# EAGLE schematic comms_dropper_robot (EAGLE 9.6.2)
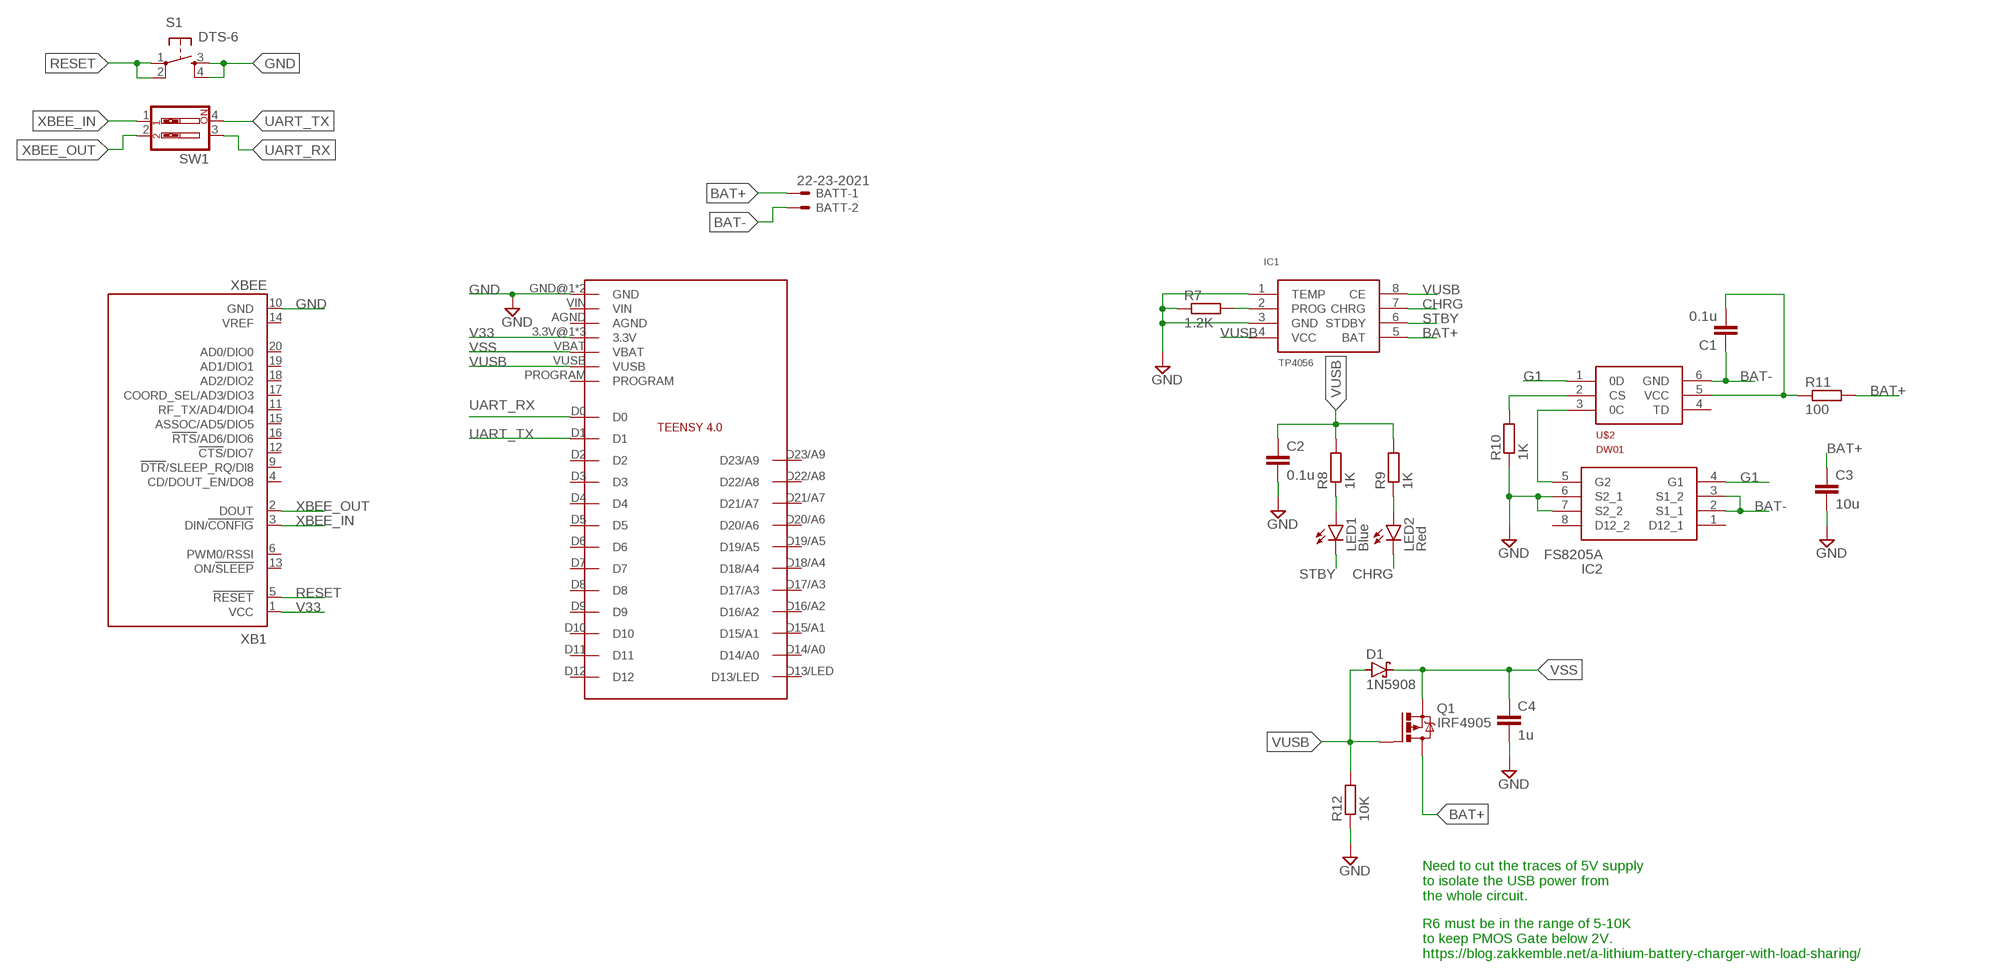
[diagram p0: schematic, sheet 1]

## Parts
BATT  22-23-2021  [22-23-2021]
C1  0.1u  C2,5-3  [C2.5-3]
C2  0.1u  C2,5-3  [C2.5-3]
C3  10u  C2,5-3  [C2.5-3]
C4  1u  C2,5-3  [C2.5-3]
D1  1N5908  [C4111-15]
IC1  TP4056  [SOP-8]
IC2  FS8205A  [SOP65P640X120-8N]
LED1  Blue  LED3MM  [LED3MM]
LED2  Red  LED3MM  [LED3MM]
Q1  IRF4905  [TO220BH]
R7  1.2K  R-EU_R0805  [R0805]
R8  1K  R-EU_R0805  [R0805]
R9  1K  R-EU_R0805  [R0805]
R10  1K  R-EU_R0805  [R0805]
R11  100  R-EU_R0805  [R0805]
R12  10K  R-EU_R0805  [R0805]
S1  DTS-6  [DTS-6]
SW1  SW_DIP-2  [EDG-02]
U$1  TEENSY4.0  [TEENSY4.0]
U$2  DW01  [SOT23-6]
XB1  XBEE  [XBEE]

## Nets
BAT+: BATT.1 C3.1 IC1.5(BAT) Q1.D R11.2
BAT-: BATT.2 C1.1 IC2.2(S1_1) IC2.3(S1_2) U$2.6(GND)
CHRG: IC1.7(CHRG) LED2.K(C)
G1: IC2.4(G1) U$2.1(0D)
GND: C2.2 C3.2 C4.2 IC1.1(TEMP) IC1.3(GND) IC2.6(S2_1) IC2.7(S2_2) R7.1 R10.1 R12.1 S1.3 S1.4 U$1.GND@1(GND) U$1.GND@2(GND) XB1.10(GND)
N$1: IC2.5(G2) U$2.3(0C)
N$2: IC1.2(PROG) R7.2
N$3: R10.2 U$2.2(CS)
N$4: C1.2 R11.1 U$2.5(VCC)
N$7: LED1.A R8.1
N$8: LED2.A R9.1
RESET: S1.1 S1.2 XB1.5(!RESET)
STBY: IC1.6(STDBY) LED1.K(C)
UART_RX: SW1.3 U$1.D0
UART_TX: SW1.4 U$1.D1
V33: U$1.3.3V@1(3.3V) U$1.3.3V@2(3.3V) U$1.ON/OFF(3.3V) XB1.1(VCC)
VSS: C4.1 D1.C Q1.S U$1.VBAT
VUSB: C2.1 D1.A IC1.4(VCC) IC1.8(CE) Q1.G R8.2 R9.2 R12.2 U$1.VUSB
XBEE_IN: SW1.1 XB1.3(DIN/!CONFIG)
XBEE_OUT: SW1.2 XB1.2(DOUT)
Unconnected: IC2.1(D12_1) IC2.8(D12_2) U$1.AGND U$1.D2 U$1.D3 U$1.D4 U$1.D5 U$1.D6 U$1.D7 U$1.D8 U$1.D9 U$1.D10 U$1.D11 U$1.D12 U$1.D13/LED U$1.D14/A0 U$1.D15/A1 U$1.D16/A2 U$1.D17/A3 U$1.D18/A4 U$1.D19/A5 U$1.D20/A6 U$1.D21/A7 U$1.D22/A8 U$1.D23/A9 U$1.PROGRAM U$1.VIN U$2.4(TD) XB1.4(CD/DOUT_EN/DO8) XB1.6(PWM0/RSSI) XB1.9(!DTR!/SLEEP_RQ/DI8) XB1.11(RF_TX/AD4/DIO4) XB1.12(!CTS!/DIO7) XB1.13(ON/!SLEEP) XB1.14(VREF) XB1.15(ASSOC/AD5/DIO5) XB1.16(!RTS!/AD6/DIO6) XB1.17(COORD_SEL/AD3/DIO3) XB1.18(AD2/DIO2) XB1.19(AD1/DIO1) XB1.20(AD0/DIO0)

## Notes on the sheet
- Need to cut the traces of 5V supply 
  to isolate the USB power from 
  the whole circuit.
- R6 must be in the range of 5-10K 
  to keep PMOS Gate below 2V.
  https://blog.zakkemble.net/a-lithium-battery-charger-with-load-sharing/

## Library data of the parts
BATT = con-molex:22-23-2021: .100" (2.54mm) Center Header - 2 Pin; MF: MOLEX; MPN: 22-23-2021; OC_FARNELL: 1462926; OC_NEWARK: 25C3832
C1-C4 = capacitor-wima:C: CAPACITOR naming: grid - package width
D1 = diode:1N5908: DIODE schottky
IC1 = TP4056:TP4056
IC2 = FS8205A:FS8205A: Dual N-Channel Enhancement Mode power MOSFET, TSSOP8 Source: Datasheet <https://datasheet.lcsc.com/szlcsc/Fortune-Semicon-FS8205A_C16052.pdf>; DESCRIPTION: Dual N-Channel Enhancement Mode power MOSFET, TSSOP8; HEIGHT: 1.2mm; MANUFACTURER_NAME: Fortune Semicon; MANUFACTURER_PART_NUMBER: FS8205A
LED1 LED2 = led:LED: LED OSRAM: - CHIPLED LG R971, LG N971, LY N971, LG Q971, LY Q971, LO R971, LY R971 LH N974, LH R974 LS Q976, LO Q976, LY Q976 LO Q996 - Hyper CHIPLED LW Q18S LB Q993, LB Q99A, LB R99A - SideLED LS A670, LO A670, LY A670, LG A670, LP A670 LB A673, LV A673, LT A673, LW A673 LH A674 LY A675 LS A676, LA A676, LO A676, LY A676, LW A676 LS A679, LY A679, LG A679 - Hyper Micro SIDELED® LS Y876, LA Y876, LO Y876, LY Y876 LT Y87S - SmartLED LW L88C, LW L88S LB L89C, LB L89S, LG L890 LS L89K, LO L89K, LY L89K LS L896, LA L896, LO L896, LY L896 - TOPLED LS T670, LO T670, LY T670, LG T670, LP T670 LSG T670, LSP T670, LSY T670, LOP T670, LYG T670 LG T671, LOG T671, LSG T671 LB T673, LV T673, LT T673, LW T673 LH T674 LS T676, LA T676, LO T676, LY T676, LB T676, LH T676, LSB T676, LW T676 LB T67C, LV T67C, LT T67C, LS T67K, LO T67K, LY T67K, LW E67C LS E67B, LA E67B, LO E67B, LY E67B, LB E67C, LV E67C, LT E67C LW T67C LS T679, LY T679, LG T679 LS T770, LO T770, LY T770, LG T770, LP T770 LB T773, LV T773, LT T773, LW T773 LH T774 LS E675, LA E675, LY E675, LS T675 LS T776, LA T776, LO T776, LY T776, LB T776 LHGB T686 LT T68C, LB T68C - Hyper Mini TOPLED® LB M676 - Mini TOPLED Santana® LG M470 LS M47K, LO M47K, LY M47K Source: http://www.osram.convergy.de LUXEON: - LUMILED® LXK2-PW12-R00, LXK2-PW12-S00, LXK2-PW14-U00, LXK2-PW14-V00 LXK2-PM12-R00, LXK2-PM12-S00, LXK2-PM14-U00 LXK2-PE12-Q00, LXK2-PE12-R00, LXK2-PE12-S00, LXK2-PE14-T00, LXK2-PE14-U00 LXK2-PB12-K00, LXK2-PB12-L00, LXK2-PB12-M00, LXK2-PB14-N00, LXK2-PB14-P00, LXK2-PB14-Q00 LXK2-PR12-L00, LXK2-PR12-M00, LXK2-PR14-Q00, LXK2-PR14-R00 LXK2-PD12-Q00, LXK2-PD12-R00, LXK2-PD12-S00 LXK2-PH12-R00, LXK2-PH12-S00 LXK2-PL12-P00, LXK2-PL12-Q00, LXK2-PL12-R00 Source: www.luxeon.com KINGBRIGHT: KA-3528ASYC Source: www.kingbright.com
Q1 = transistor-power:IRF4905: P-Channel HEXFET® Power MOSFET RDS(on)= 0.02 Ohm, ID = -74A Source: http://www.irf.com/product-info/datasheets/data/irf4905pbf.pdf
R7-R12 = rcl:R-EU_: RESISTOR, European symbol; SPICEPREFIX: R
S1 = switch-tact:DTS-6
SW1 = special:SW_DIP-2: DIP SWITCH
U$1 = Teensy4.0:TEENSY4.0
U$2 = DW01:DW01: The DW01-P battery protection IC is designed to protect lithium-ion/polymer battery from damage or degrading the lifetime due to overcharge, overdischarge, and/or overcurrent for one-cell lithium-ion/polymer battery powered systems, such as cellular phones. Data sheet <http://goo.gl/4y108d> Dave.Calaway Eagle Library <https://goo.gl/Muy1Tr>
XB1 = maxstream:XBEE: XBee (TM) /XBee-PRO(TM) OEM RF Modules Source: MaxStream, Inc. xbee_productmanual.pdf; MPN: XBP24-Z7UIT-004; OC_FARNELL: 1751799; OC_NEWARK: 34R5507